# EAGLE design multishield (EAGLE 8.6.1)
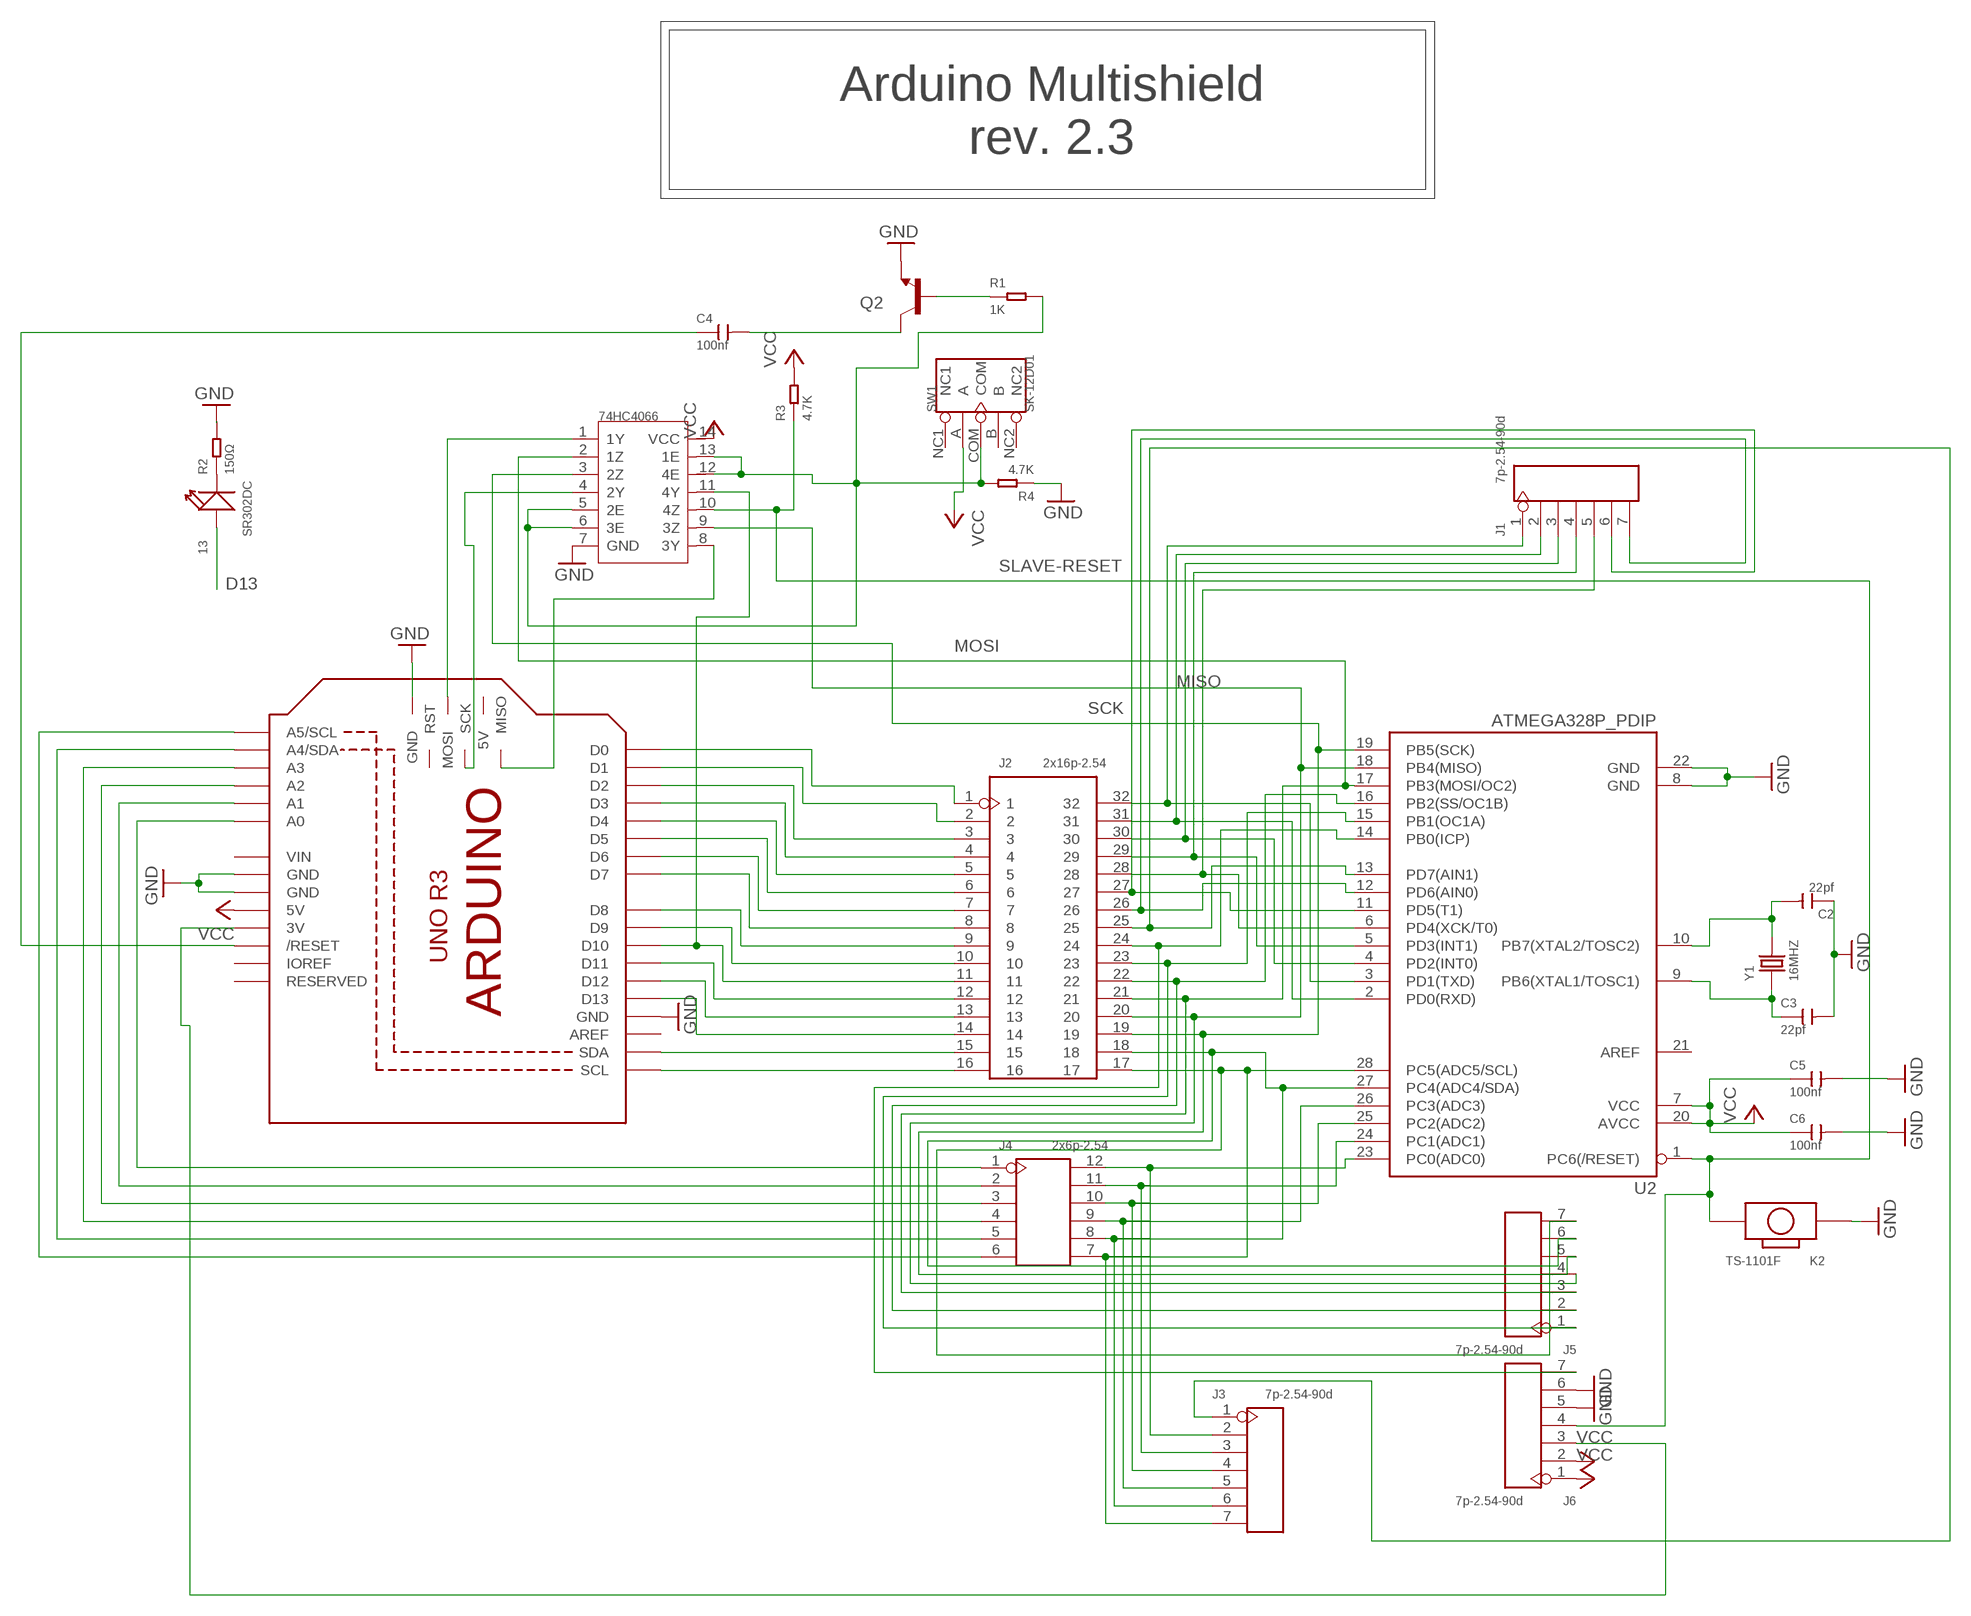
[diagram p0: schematic, sheet 1]

## Parts
13  SR302DC  DIP-LED-RED-RED(2P-D3MM)  [LED2-2.54-D3.0MM]
C2  22pf  DIP-CERAMIC-DISC-22PF-50V-10%-NPO(D4.0MM)  [CERAMIC-2.54]
C3  22pf  DIP-CERAMIC-DISC-22PF-50V-10%-NPO(D4.0MM)  [CERAMIC-2.54]
C4  100nf  DIP-CERAMIC-DISC-100NF-50V-Y5V(D5.0MM)  [CERAMIC-2.54]
C5  100nf  DIP-CERAMIC-DISC-100NF-50V-Y5V(D5.0MM)  [CERAMIC-2.54]
C6  100nf  DIP-CERAMIC-DISC-100NF-50V-Y5V(D5.0MM)  [CERAMIC-2.54]
J1  7p-2.54-90d  DIP-BLACK-MALE-HEADER(7P-2.54-90D)  [H7-2.54-90D-MALE]
J2  2x16p-2.54  DIP-BLACK-MALE-HEADER-VERT(2X16P-2.54)  [H2X16-2.54]
J3  7p-2.54-90d  DIP-BLACK-MALE-HEADER(7P-2.54-90D)  [H7-2.54-90D-MALE]
J4  2x6p-2.54  DIP-BLACK-MALE-HEADER(2X6P-2.54)  [H2X6-2.54]
J5  7p-2.54-90d  DIP-BLACK-MALE-HEADER(7P-2.54-90D)  [H7-2.54-90D-MALE]
J6  7p-2.54-90d  DIP-BLACK-MALE-HEADER(7P-2.54-90D)  [H7-2.54-90D-MALE]
K2  TS-1101F  DIP-BUTTON-FRONT-WHITE(2P-3.4X6MM)  [SW2-3.4X6.0X3.55MM-90D]
M1  ARDUINO_R3_ICSP  [ARDUINOR3_ICSP]
Q2  TRANSISTOR_NPNBC547  [TO-92-AMMO]
R1  1K  DIP-RES-1K-5%-1/4W(PR-D2.3XL6.5MM)  [PR-D2.3XL6.5MM]
R2  150Ω  DIP-RES-1K-5%-1/4W(PR-D2.3XL6.5MM)  [PR-D2.3XL6.5MM]
R3  4.7K  DIP-RES-4.7K-5%-1/4W(PR-D2.3XL6.5MM)  [PR-D2.3XL6.5MM]
R4  4.7K  DIP-RES-4.7K-5%-1/4W(PR-D2.3XL6.5MM)  [PR-D2.3XL6.5MM]
SW1  SK-12D01  DIP-TOGGLE-SWITCH-ON-ON(3+2P-8.8X4.6MM)  [SW5-2.0-8.8X4.4X4.7MM-90D]
U1  AD595AQ-DIP14  74HC4066(DIP14)  [DIP14-2.54-17.24X6.35MM]
U2  ATMEGA328P_PDIP  [DIL28-3]
Y1  16MHZ  DIP-CRYSTAL-16MHZ-18PF-30PPM-50R(HC49US)  [HC49US]

## Nets
D9A: J2.10 M1.D9
D9B: J2.23 J5.1 U2.15(PB1(OC1A))
GND: C2.1 C3.2 C5.2 C6.2 J6.5 J6.6 K2.P$1 M1.GND M1.GND@1(GND) M1.GND@2(GND) M1.GND@3(GND) Q2.3(E) R2.2 R4.1 U1.7(GND) U2.8(GND) U2.22(GND)
MISO: J2.20 J5.4 U1.9(3Z) U2.18(PB4(MISO))
MOSI: J2.21 J5.3 U1.2(1Z) U2.17(PB3(MOSI/OC2))
N$2: J2.1 M1.D0
N$9: J2.2 M1.D1
N$11: J2.3 M1.D2
N$12: J2.4 M1.D3
N$13: J2.5 M1.D4
N$14: J2.6 M1.D5
N$15: J2.7 M1.D6
N$16: J2.8 M1.D7
N$17: J2.9 M1.D8
N$18: 13.K(-) R2.1
N$19: J2.11 M1.D10 U1.11(4Y)
N$20: J2.12 M1.D11
N$21: J2.13 M1.D12
N$22: J2.14 M1.D13
N$23: J2.15 M1.SDA
N$24: J2.16 M1.SCL
N$25: J1.1 J2.32 U2.3(PD1(TXD))
N$26: J1.2 J2.31 U2.2(PD0(RXD))
N$27: J1.3 J2.30 U2.4(PD2(INT0))
N$28: J1.4 J2.29 U2.5(PD3(INT1))
N$29: J1.5 J2.28 U2.6(PD4(XCK/T0))
N$30: J1.6 J2.27 U2.11(PD5(T1))
N$31: J4.1 M1.A0
N$32: J2.25 J3.1 U2.13(PD7(AIN1))
N$33: J2.24 J6.7 U2.14(PB0(ICP))
N$35: J2.22 J5.2 U2.16(PB2(SS/OC1B))
N$36: C4.2 Q2.1(C)
N$37: C4.1 M1.RESET(/RESET)
N$38: Q2.2(B) R1.1
N$39: M1.MOSI U1.1(1Y)
N$40: M1.SCK U1.4(2Y)
N$41: J1.7 J2.26 U2.12(PD6(AIN0))
N$42: J4.2 M1.A1
N$43: J4.3 M1.A2
N$44: J4.4 M1.A3
N$45: J3.2 J4.12 U2.23(PC0(ADC0))
N$46: J3.3 J4.11 U2.24(PC1(ADC1))
N$47: J3.4 J4.10 U2.25(PC2(ADC2))
N$48: J3.5 J4.9 U2.26(PC3(ADC3))
N$49: J2.18 J3.6 J4.8 J5.6 U2.27(PC4(ADC4/SDA))
N$50: J2.17 J3.7 J4.7 J5.7 U2.28(PC5(ADC5/SCL))
N$51: J4.5 M1.A4(A4/SDA)
N$52: J4.6 M1.A5(A5/SCL)
N$53: M1.MISO U1.8(3Y)
N$54: J6.3 M1.3V
N$55: C2.2 U2.10(PB7(XTAL2/TOSC2)) Y1.2
N$56: R1.2 R4.2 SW1.COM U1.5(2E) U1.6(3E) U1.12(4E) U1.13(1E)
N$57: C3.1 U2.9(PB6(XTAL1/TOSC1)) Y1.1
SCK: 13.A(+) J2.19 J5.5 U1.3(2Z) U2.19(PB5(SCK))
SLAVE-RESET: J6.4 K2.P$2 R3.1 U1.10(4Z) U2.1(PC6(/RESET))
VCC: C5.1 C6.1 J6.1 J6.2 M1.5V R3.2 SW1.A U1.14(VCC) U2.7(VCC) U2.20(AVCC)
Unconnected: M1.5V_ICSP(5V) M1.AREF M1.IOREF M1.RESERVED M1.RESET_ICSP(RST) SW1.B SW1.NC1 SW1.NC2 U2.21(AREF)

## Notes on the sheet
- Arduino Multishield
  rev. 2.3
- D13

## Power pins joined to a net without a drawn wire
VIN: M1.VIN

## Library data of the parts
13 = Seeed-OPL-Diode:DIP-LED-RED-RED(2P-D3MM): 304090041; MPN: SR302DC
C2 C3 = Seeed-OPL-Capacitor:DIP-CERAMIC-DISC-22PF-50V-10%-NPO(D4.0MM): 302010200; MPN: CS1-D5Y5V2A104ZSP
C4-C6 = Seeed-OPL-Capacitor:DIP-CERAMIC-DISC-100NF-50V-Y5V(D5.0MM): 302010208; MPN: CC1-F5SL2A101KSPW
J1 J3 J5 J6 = Seeed-OPL-Connector:DIP-BLACK-MALE-HEADER(7P-2.54-90D): 320020093; MPN: P125-1107A0BR138A1
J2 = Seeed-OPL-Connector:DIP-BLACK-MALE-HEADER-VERT(2X16P-2.54): 320020049; MPN: P125-1232A0AS116A1
J4 = Seeed-OPL-Connector:DIP-BLACK-MALE-HEADER(2X6P-2.54): 320020001; MPN: P125-1212A0AS116A1
K2 = Seeed-OPL-Button:DIP-BUTTON-FRONT-WHITE(2P-3.4X6MM): 311020025; MPN: TS-1101F
M1 = adafruit:ARDUINO_R3_ICSP
Q2 = SparkFun-DiscreteSemi:TRANSISTOR_NPN: Generic NPN BJT MMBT2222A - TRANS-08049 (SOT-23, 1A 40V) MPSA42 - TRANS-09116 (SOT-23, 500mA 300V) MMBT5088LT1G - TRANS-11160 (SOT-23, 50 mA 30V) BC547 - COM-08928 <http://www.sparkfun.com/products/8928> (TO-92 45V 100mA) (1.Collector 2.Base 3.Emitter) 2N3904 - COM-00521 <http://www.sparkfun.com/products/521> (TO-92 40V 200mA) (1.Emitter 2.Base 3.Collector) P2N2222A - COM-12852 <http://www.sparkfun.com/products/12852> (TO-92 40V 600mA) (1.Collector 2.Base 3.Emitter)
R1 = Seeed-OPL-Resistor:DIP-RES-1K-5%-1/4W(PR-D2.3XL6.5MM): 301020000; MPN: FHCFR-1/4W-102J
R2 = Seeed-OPL-Resistor:DIP-RES-1K-5%-1/4W(PR-D2.3XL6.5MM): 301020000; MPN: FHCFR-1/4W-102J; VALUE: 1K
R3 R4 = Seeed-OPL-Resistor:DIP-RES-4.7K-5%-1/4W(PR-D2.3XL6.5MM): 301020012; MPN: FHCFR-1/4W-472J
SW1 = Seeed-OPL-Button:DIP-TOGGLE-SWITCH-ON-ON(3+2P-8.8X4.6MM): 311030008; MPN: SK-12D01
U1 = Seeed-OPL-ic:74HC4066(DIP14): 310030269; MPN: AD595AQ
U2 = SparkFun-DigitalIC:ATMEGA328P_PDIP: uC used in the Arduino 32kb flash, 1k EEPROM, 2k SRAM This is the through-hole version of this chip.
Y1 = Seeed-OPL-Crystal-Oscillator:DIP-CRYSTAL-16MHZ-18PF-30PPM-50R(HC49US): 306010037; MPN: 49S/18PF

## Net classes
0 default: width 0.152 mm, drill 0.305 mm, clearance 0.152 mm

## Board
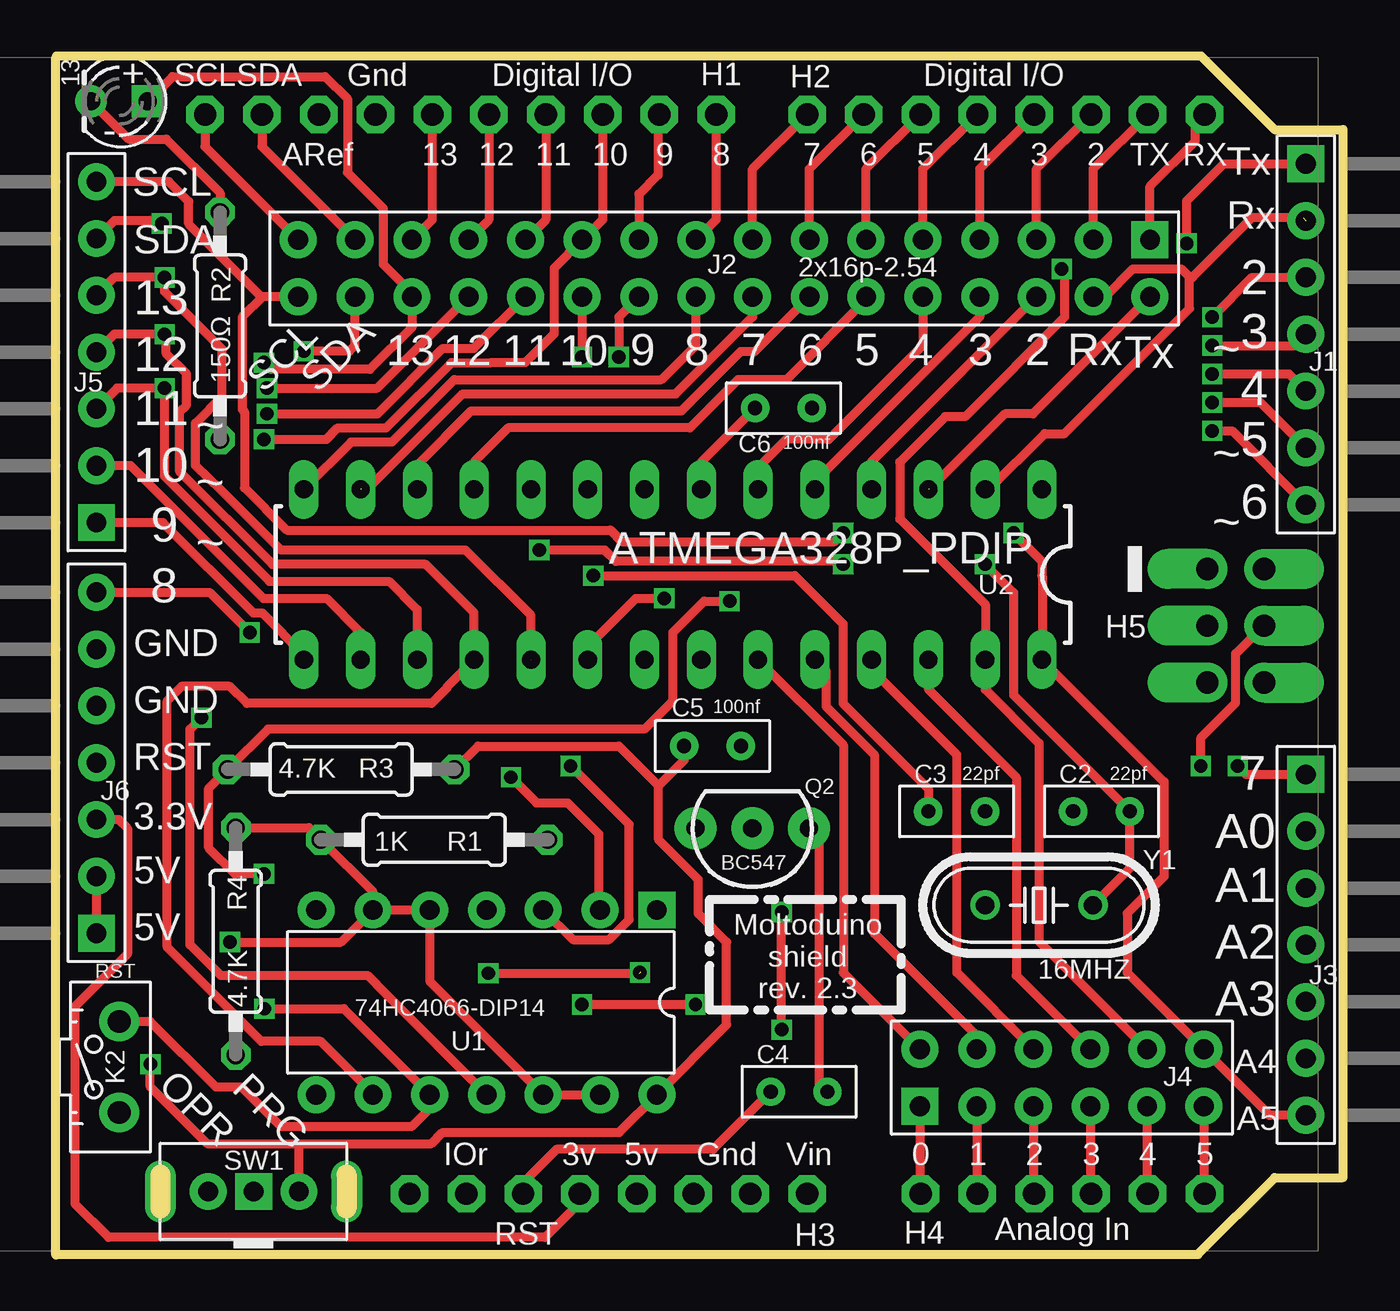
[diagram p1: board, top side]
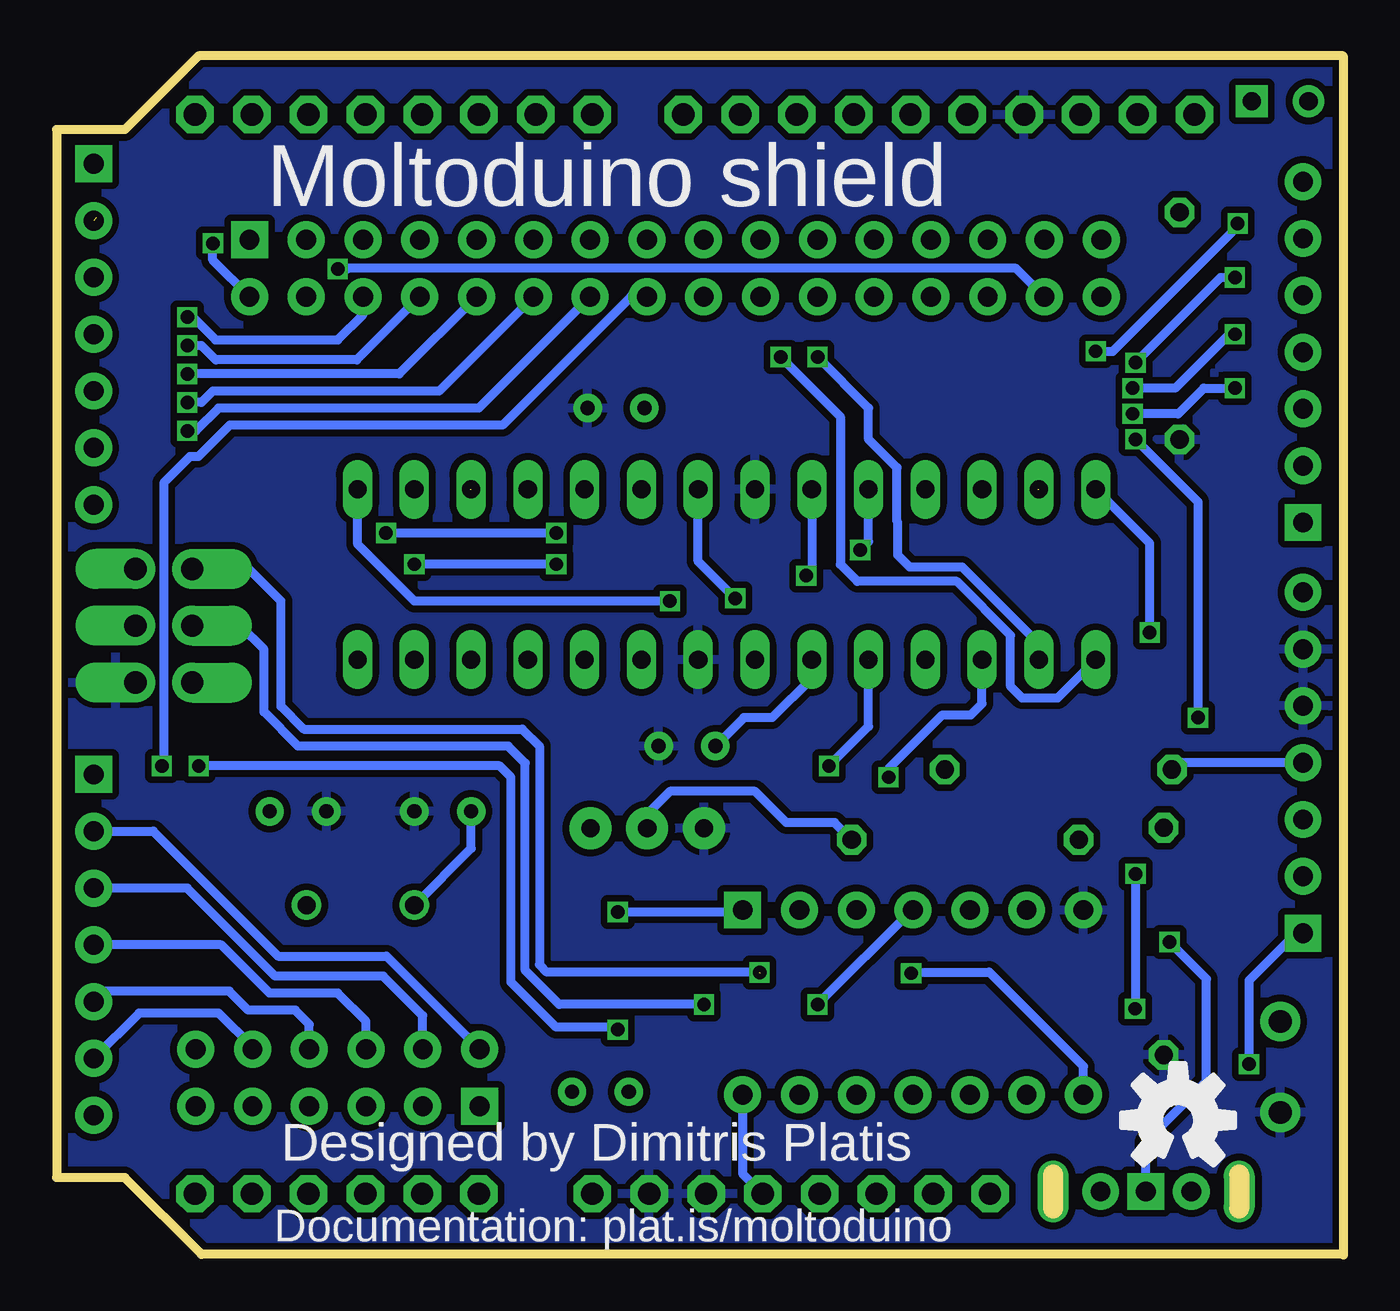
[diagram p2: board, bottom side, seen from below]

Size 57.57 x 53.62 mm. Coordinates in mm from the lower left corner, seen from the top.
Outline: 0,0 0,53.56
Outline: 0.04,0.03 51.09,0.03 54.52,3.46 57.57,3.46 57.57,50.32 54.52,50.32 51.22,53.62 0.04,53.62
Copper layers (1*16): Top 0.035mm / dielectric 1.5mm / Bottom 0.035mm
Design rules "SeeedStudio_2layer_DRU_no_angle_20140221": minimum track width 6mil, minimum drill 12mil, track to track 6mil, track to pad 6mil, pad to pad 6mil, via to via 6mil, smd to smd 0mil, copper to edge 10mil, drill to drill 10mil, minimum pad ring 10mil, minimum via ring 6mil, stop-mask expansion 2mil, vias tented up to drill 100mil, thermal gap 10mil

### Footprints (pad centres in the part's own frame; a part is rotated, then mirrored left to right if it is on the bottom)
LED2-2.54-D3.0MM = drill 0.813 pad 1.422 square: A -1.27,0 | drill 0.813 pad 1.422: K 1.27,0
CERAMIC-2.54 = drill 0.635 pad 1.27: 1 -1.27,0; 2 1.27,0
H7-2.54-90D-MALE = drill 0.889 pad 1.651 square: 1 0,7.62 | drill 0.889 pad 1.651: 2 0,5.08; 3 0,2.54; 4 0,0; 5 0,-2.54; 6 0,-5.08; 7 0,-7.62
H2X16-2.54 = drill 0.889 pad 1.651 square: 1 -1.27,19.05 | drill 0.889 pad 1.651: 2 -1.27,16.51; 3 -1.27,13.97; 4 -1.27,11.43; 5 -1.27,8.89; 6 -1.27,6.35; 7 -1.27,3.81; 8 -1.27,1.27; 9 -1.27,-1.27; 10 -1.27,-3.81; 11 -1.27,-6.35; 12 -1.27,-8.89; 13 -1.27,-11.43; 14 -1.27,-13.97; 15 -1.27,-16.51; 16 -1.27,-19.05; 17 1.27,-19.05; 18 1.27,-16.51; 19 1.27,-13.97; 20 1.27,-11.43; 21 1.27,-8.89; 22 1.27,-6.35; 23 1.27,-3.81; 24 1.27,-1.27; 25 1.27,1.27; 26 1.27,3.81; 27 1.27,6.35; 28 1.27,8.89; 29 1.27,11.43; 30 1.27,13.97; 31 1.27,16.51; 32 1.27,19.05
H2X6-2.54 = drill 0.889 pad 1.651 square: 1 -1.27,6.35 | drill 0.889 pad 1.651: 2 -1.27,3.81; 3 -1.27,1.27; 4 -1.27,-1.27; 5 -1.27,-3.81; 6 -1.27,-6.35; 7 1.27,-6.35; 8 1.27,-3.81; 9 1.27,-1.27; 10 1.27,1.27; 11 1.27,3.81; 12 1.27,6.35
SW2-3.4X6.0X3.55MM-90D = drill 1.016 pad 1.778: P$1 2.032,-0.127; P$2 -2.032,-0.127
ARDUINOR3_ICSP = drill 1 pad 1.676 octagon: 3V 35.56,2.54; 5V 38.1,2.54; A0 50.8,2.54; A1 53.34,2.54; A2 55.88,2.54; A3 58.42,2.54; A4 60.96,2.54; A5 63.5,2.54; AREF 23.876,50.8; D0 63.5,50.8; D1 60.96,50.8; D2 58.42,50.8; D3 55.88,50.8; D4 53.34,50.8; D5 50.8,50.8; D6 48.26,50.8; D7 45.72,50.8; D8 41.656,50.8; D9 39.116,50.8; D10 36.576,50.8; D11 34.036,50.8; D12 31.496,50.8; D13 28.956,50.8; GND 26.416,50.8; GND@1 43.18,2.54; GND@2 40.64,2.54; IOREF 30.48,2.54; RESERVED 27.94,2.54; RESET 33.02,2.54; SCL 18.796,50.8; SDA 21.336,50.8; VIN 45.72,2.54 | drill 1 pad 1.778 offset: 5V_ICSP 66.167,30.48; GND@3 66.167,25.4; MISO 63.627,30.48; MOSI 66.167,27.94; RESET_ICSP 63.627,25.4; SCK 63.627,27.94
TO-92-AMMO = drill 0.813 pad 1.88: 1 -2.54,0; 2 0,0; 3 2.54,0
PR-D2.3XL6.5MM = drill 0.813 octagon: 1 -4.953,0; 2 5.207,0
SW5-2.0-8.8X4.4X4.7MM-90D = drill 0.889 pad 1.651: A 0,2.032; B 0,-2.032 | drill 0.889 pad 1.651 square: COM 0,0 | drill 0.762 pad 1.397 long: NC1 0,4.166; NC2 0,-4.166
DIP14-2.54-17.24X6.35MM = drill 0.889 pad 1.651 square: 1 -7.62,-4.128 | drill 0.889 pad 1.651: 2 -5.08,-4.128; 3 -2.54,-4.128; 4 0,-4.128; 5 2.54,-4.128; 6 5.08,-4.128; 7 7.62,-4.128; 8 7.62,4.128; 9 5.08,4.128; 10 2.54,4.128; 11 0,4.128; 12 -2.54,4.128; 13 -5.08,4.128; 14 -7.62,4.128
DIL28-3 = drill 0.813 long: 1 -16.51,-3.81; 2 -13.97,-3.81; 3 -11.43,-3.81; 4 -8.89,-3.81; 5 -6.35,-3.81; 6 -3.81,-3.81; 7 -1.27,-3.81; 8 1.27,-3.81; 9 3.81,-3.81; 10 6.35,-3.81; 11 8.89,-3.81; 12 11.43,-3.81; 13 13.97,-3.81; 14 16.51,-3.81; 15 16.51,3.81; 16 13.97,3.81; 17 11.43,3.81; 18 8.89,3.81; 19 6.35,3.81; 20 3.81,3.81; 21 1.27,3.81; 22 -1.27,3.81; 23 -3.81,3.81; 24 -6.35,3.81; 25 -8.89,3.81; 26 -11.43,3.81; 27 -13.97,3.81; 28 -16.51,3.81
HC49US = drill 0.813: 1 -2.413,0; 2 2.413,0

### Placement (x,y rotation side)
13  2.84,51.59 180 top
C2  46.77,19.84 0 top
C3  40.3,19.84 0 top
C4  33.24,7.3 0 top
C5  29.37,22.76 0 top
C6  32.55,37.87 0 top
J1  55.92,41.17 0 top
J2  29.89,44.12 270 top
J3  55.92,13.87 0 top
J4  45,7.93 90 top
J5  1.81,40.38 180 top
J6  1.81,22.01 180 top
K2  2.96,8.41 270 top
M1  -12.12,0.2 0 top
Q2  31.15,19.08 180 top
R1  17.05,18.57 180 top
R2  7.34,41.67 270 top
R3  12.63,21.71 0 top
R4  8.04,13.9 90 top
SW1  8.84,2.84 270 top
U1  19.26,11.3 180 top
U2  27.6,30.43 180 top
U$4  [OSHWLOGO_BACK_0.2]  7.4,6.03 0 top
Y1  43.98,15.65 0 top

### Tracks (layer width: path | path; a pad name or v marks a point on that pad's centre or on a via)
D9A
  Top 0.406: M1.D9 26.94,50.95 26.94,48.3 26.08,47.44 J2.10
D9B  (via drill 0.6)
  Top 0.406: v25.18,40.16 25.18,41.95 J2.23 26.1,42.85 | U2.15 11.09,26.85 9.24,28.7 8.84,28.7 4.79,32.75 J5.1
  Bottom 0.406: v25.18,40.16 22.52,37.49 22.52,30.89 21.75,30.13 17.31,30.13 14.9,27.71 14.9,25.43 14.39,24.92 12.79,24.92 U2.15
GND
  pour Bottom (isolate 0.305): 0.35,53.56 57.46,53.44 57.46,0.03 0.4,0.15
MISO  (via drill 0.6)
  Top 0.406: v9.44,38.76 14.37,38.76 J2.20 | U1.9 14.18,7.22 11.85,9.55 9.19,9.55 4.99,13.75 4.99,24.79 5.62,25.43 7.78,25.43 8.55,24.66 16.8,24.66 17.52,25.38 17.52,25.43 U2.18 18.71,28.73 16.55,30.89 9.69,30.89 5.54,35.03 5.54,37.7 5.84,38 5.84,39.4 4.94,40.3 4.94,41.09 v4.86,41.17 2.61,41.17 J5.4
  Bottom 0.406: v9.44,38.76 7.53,38.76 5.12,41.17 v4.86,41.17
MOSI  (via drill 0.6)
  Top 0.406: U1.2 24.29,15.47 24.29,18.82 22.9,20.22 21.5,20.22 v20.36,21.36 | U2.17 16.17,28.86 14.9,30.13 9.56,30.13 4.86,34.82 v4.86,38.76 2.74,38.76 J5.3 | v9.44,37.62 14.39,37.62 17.31,40.54 18.69,40.54 J2.21
  Bottom 0.406: U2.17 16.17,24.66 16.67,24.16 17.94,24.16 20.36,21.74 v20.36,21.36 | v9.44,37.62 7.4,37.62 6.26,38.76 v4.86,38.76
N$2
  Top 0.406: J2.1 48.95,47.79 50.96,49.81 50.96,50.58 M1.D0
N$9
  Top 0.406: J2.2 46.41,48.56 M1.D1
N$11
  Top 0.406: J2.3 43.87,48.56 M1.D2
N$12
  Top 0.406: J2.4 41.33,48.56 M1.D3
N$13
  Top 0.406: J2.5 38.79,48.56 M1.D4
N$14
  Top 0.406: J2.6 36.25,48.56 M1.D5
N$15
  Top 0.406: J2.7 33.71,48.56 M1.D6
N$16
  Top 0.406: J2.8 31.16,48.56 M1.D7
N$17
  Top 0.406: M1.D8 29.54,46.3 J2.9
N$18
  Top 0.406: R2.1 7.34,47.5 4.94,49.9 3.26,49.9 13.K
N$19  (via drill 0.6)
  Top 0.406: M1.D10 24.46,46.3 J2.11 22.29,44.14 22.29,41.2 20.99,39.91 19.47,39.91 | U1.11 14.37,12.07 14.37,12.08 13.94,12.5 7.38,12.5 6.01,13.87 6.01,23.52 v6.51,24.03 | 19.47,39.91 17.69,39.91 14.77,36.98 12.61,36.98 12.1,36.48 v9.31,36.48 | 19.47,39.91 19.48,39.91
  Bottom 0.406: v6.51,24.03 6.51,33.68 v9.31,36.48
N$20
  Top 0.406: M1.D11 21.92,46.3 J2.12
N$21
  Top 0.406: M1.D12 19.38,46.3 J2.13
N$22
  Top 0.406: M1.D13 16.84,46.3 J2.14
N$23
  Top 0.406: M1.SDA 9.22,49.56 J2.15
N$24
  Top 0.406: M1.SCL 6.68,49.56 J2.16
N$25  (via drill 0.6)  (1 unrouted)
  Top 0.406: v50.58,45.24 50.58,47.14 52.23,48.8 J1.1 | J2.32 43.71,37.62 42.46,37.62 39.08,34.24
  Bottom 0.406: J2.32 50.58,44.49 v50.58,45.24
N$26  (1 unrouted)
  Top 0.406: J2.31 46.94,42.85 48.18,44.1 50.34,44.1 50.72,43.71 | 50.72,43.71 50.84,43.71 53.5,46.38 55.79,46.38 | 50.72,43.71 50.71,43.7 50.71,42.32 45.12,36.73 44.23,36.73 41.74,34.24 U2.2
N$27  (via drill 0.6)
  Top 0.406: U2.4 36.49,35.48 J2.30 | J1.3 53.5,43.71 v51.73,41.94
  Bottom 0.406: J2.30 43.87,42.05 45,40.92 50.47,40.92 50.47,40.93 51.47,41.94 v51.73,41.94
N$28  (via drill 0.6)
  Top 0.406: J2.29 41.33,41.95 33.95,34.58 U2.5 | v51.73,40.67 55.41,40.67 J1.4
  Bottom 0.406: J2.29 44.15,40.03 50.46,40.03 51.09,40.67 v51.73,40.67
N$29  (via drill 0.6)
  Top 0.406: J2.28 38.79,40.68 34.58,36.48 32.68,36.48 31.41,35.21 U2.6 | v51.73,39.4 55.16,39.4 J1.5
  Bottom 0.406: J2.28 42.24,39.4 v51.73,39.4
N$30  (via drill 0.6)
  Top 0.406: U2.11 18.71,35.47 20.23,36.98 28.36,36.98 30.52,39.14 32.68,39.14 36.25,42.71 J2.27 | J1.6 53.89,38.13 v51.73,38.13
  Bottom 0.406: J2.27 40.46,38.63 50.58,38.63 51.09,38.13 v51.73,38.13
N$31
  Top 0.406: J4.1 38.65,2.77 M1.A0
N$32  (via drill 0.6)  (1 unrouted)
  Top 0.406: J2.25 31.16,41.95 27.72,38.51 18.2,38.51 13.93,34.24 13.68,34.24 | v52.87,21.87 53.25,21.49 J3.1
  Bottom 0.406: J2.25 31.89,42.85 37.63,37.11 49.82,37.11 51.22,35.71 51.6,35.71 52.78,34.53 52.78,21.96 v52.87,21.87
N$33  (via drill 0.6)
  Top 0.406: J2.24 28.62,40.68 27.09,39.14 17.82,39.14 15.02,36.35 13.2,36.35 U2.14 | J6.7 6.88,29.63 v8.67,27.84
  Bottom 0.406: v8.67,27.84 8.67,31.82 U2.14
N$35  (via drill 0.6)
  Top 0.406: J2.22 23.54,40.17 v23.53,40.16 | U2.16 13.63,27.83 12.1,29.36 9.28,29.36 3.34,35.3 J5.2
  Bottom 0.406: v23.53,40.16 21.25,37.87 21.25,36.48 19.98,35.21 19.98,32.79 19.94,32.76 19.94,31.3 19.4,30.76 17.05,30.76 13.63,27.34 U2.16
N$36
  Top 0.406: Q2.1 34.14,18.63 34.14,7.67 C4.2
N$37
  Top 0.406: M1.RESET 20.9,3.24 22.39,4.73 29.4,4.73 C4.1
N$38
  Bottom 0.406: R1.1 22.77,19.33 24.93,19.33 26.33,20.73 30.14,20.73 31.15,19.71 Q2.2
N$39  (via drill 0.6)
  Top 0.406: v32.47,10.08 v32.47,15.34 | v51.22,21.87 51.22,23.14 52.78,24.7 52.78,26.89 M1.MOSI
  Bottom 0.406: v32.47,15.34 26.96,15.34 U1.1 | v32.47,10.08 32.58,10.19 35.23,10.19 37.24,12.2 37.24,21.36 37.76,21.87 v51.22,21.87
N$40  (via drill 0.6)
  Top 0.406: v23.53,11.2 v28.61,11.2
  Bottom 0.406: v23.53,11.2 19.31,15.43 U1.4 | v28.61,11.2 35.09,11.2 36.61,12.73 36.61,22 37.38,22.76 46.77,22.76 48.3,24.28 48.3,27.08 49.36,28.14 M1.SCK
N$41  (via drill 0.6)
  Top 0.406: J2.26 31.26,40.41 30.64,40.41 27.98,37.75 18.58,37.75 16.17,35.34 U2.12 | v51.73,36.86 52.62,36.86 J1.7
  Bottom 0.406: J2.26 38.69,37.87 50.33,37.87 51.34,36.86 v51.73,36.86
N$42
  Top 0.406: J4.2 41.19,2.77 M1.A1
N$43
  Top 0.406: J4.3 43.73,2.77 M1.A2
N$44
  Top 0.406: J4.4 46.27,2.77 M1.A3
N$45
  Top 0.406: J4.12 35.22,12.63 35.22,22.81 U2.23
  Bottom 0.406: 38.8,9.2 J4.12 42.81,13.36 47.66,13.36 53.25,18.95 J3.2
N$46
  Top 0.406: U2.24 34.45,26.12 34.45,24.54 36.61,22.38 36.61,14.38 41.19,9.8 J4.11
  Bottom 0.406: J4.11 41.19,10.7 42.96,12.47 47.79,12.47 51.73,16.41 J3.3
N$47
  Top 0.406: U2.25 36.49,26.18 40.3,22.38 40.3,12.63 J4.10
  Bottom 0.406: J4.10 43.73,10.45 45,11.71 48.04,11.71 50.2,13.87 J3.4
N$48
  Top 0.406: J4.9 42.96,12.51 42.96,21.36 39.03,25.29 U2.26
  Bottom 0.406: J4.9 46.27,10.31 46.9,10.95 48.99,10.95 49.84,11.8 55.45,11.8 J3.5
N$49  (via drill 0.6)
  Top 0.406: J4.8 43.98,14.03 43.98,22.89 41.57,25.29 U2.27 41.57,29.1 37.76,32.92 37.76,35.46 39.79,37.49 40.68,37.49 45.12,41.94 45.12,43.97 v45,44.1 | J2.18 13.37,40.67 13.12,40.41 v11.09,40.41 | v4.74,46.13 4.61,46.25 2.61,46.25 J5.6
  Bottom 0.406: J2.18 14.65,44.12 44.55,44.12 44.58,44.1 v45,44.1 | J4.8 48.81,9.3 50.33,10.82 53.89,10.82 J3.6 | U2.27 | v11.09,40.41 10.32,40.41 4.74,46 v4.74,46.13
N$50  (via drill 0.6)
  Top 0.406: J3.7 54.3,6.25 J4.7 47.92,12.63 47.92,15.27 49.57,16.92 49.57,21.16 U2.28 44.12,30.38 44.11,30.39 44.11,31.01 v42.84,32.28 | v35.22,32.28 34.84,31.9 25.31,31.9 24.8,32.41 10.33,32.41 8.44,34.3 8.44,37.7 8.34,37.8 8.34,41.95 9.24,42.85 | J2.17 9.24,42.85 | 9.24,42.85 9.19,42.85 5.94,46.1 5.94,47.1 5.05,47.99 J5.7
  Bottom 0.406: v35.22,32.28 v42.84,32.28
N$51
  Top 0.406: J4.5 48.81,2.77 M1.A4
N$52
  Top 0.406: J4.6 51.35,2.77 M1.A5
N$53  (via drill 0.6)  (2 unrouted)
  Top 0.406: v19.34,12.6 26.09,12.6
  Bottom 0.406: U1.8 11.64,8.44 15.85,12.65 15.87,12.63 19.31,12.63 v19.34,12.6 | 26.15,12.65 35.65,12.65 35.98,12.98 35.98,22.76 36.74,23.52 46.52,23.52 47.54,24.54 47.54,29.24 48.98,30.68 M1.MISO
  other vias: 26.13,12.63
N$54
  Top 0.406: M1.3V 23.44,2.35 21.88,0.79 2.35,0.79 0.84,2.3 0.84,11.1 3.21,13.47 3.21,19.08 2.81,19.47 J6.3
N$55  (via drill 0.6)
  Top 0.406: Y1.2 48.04,17.3 C2.2 42.84,25.05 42.84,29.62 v41.57,30.89 | v21.63,31.52 24.55,31.52 25.06,31.01 35.09,31.01 v35.22,30.89
  Bottom 0.406: v21.63,31.52 21.25,31.9 U2.10 | v35.22,30.89 v41.57,30.89
N$56  (via drill 0.6)
  Top 0.406: U1.13 U1.12 16.72,12.25 U1.5 U1.6 | v7.78,14 12.75,14 U1.6 | U1.6 14.18,16.24 R1.2 11.31,19.11 R4.2
  Bottom 0.406: v7.78,14 6.13,12.35 6.13,7.77 8.84,5.07 SW1.COM
N$57  (via drill 0.6)
  Top 0.406: v24.04,30.38 33.06,30.38 35.22,28.22 35.22,24.66 39.03,20.85 C3.1
  Bottom 0.406: Y1.1 39.03,18.19 C3.1 | U2.9 23.79,30.63 v24.04,30.38
SCK  (via drill 0.6)  (1 unrouted)
  Top 0.406: U2.19 21.25,28.6 18.32,31.52 10.07,31.52 7.4,34.19 6.24,35.3 6.24,37.2 7.44,38.4 7.44,40.5 4.86,43.08 v4.86,43.71 2.61,43.71 J5.5 | v9.31,39.91 9.61,39.6 14.04,39.6 15.92,41.48 J2.19 15.92,43.02 14.64,44.3 14.64,46.8 13.04,48.4 13.04,51.7 12.04,52.7 5.22,52.7 13.A | U1.3 23.13,14.1 24.74,14.1 25.64,15 25.64,19.25 v23.02,21.87
  Bottom 0.406: U2.19 21.25,23.64 v23.02,21.87 | v9.31,39.91 5.5,43.71 v4.86,43.71
SLAVE-RESET  (via drill 0.6)
  Top 0.406: v30.14,29.24 28.99,29.24 27.6,27.84 27.6,24.79 26.33,23.52 9.49,23.52 R3.1 6.84,20.88 6.84,18.2 8,17.04 v9.31,17.04 | K2.P$2 4.23,10.44 7.15,7.52 8.29,7.52 10.07,5.74 15.91,5.74 16.72,6.55 U1.10 12.88,11.01 v9.33,11.01
  Bottom 0.406: v30.14,29.24 41.57,29.24 44.11,31.78 U2.1 | v9.31,17.04 9.31,11.04 v9.33,11.01 | J6.4 7.38,22.01 R3.1
VCC  (via drill 0.6)
  Top 0.406: 26.96,20.98 26.96,18.57 28.74,16.79 28.74,15.27 30.01,14 30.01,10.3 U1.14 25.2,5.49 17.31,5.49 16.8,4.98 10.83,4.98 | R3.2 18.88,22.76 25.18,22.76 26.96,20.98 | 10.83,4.98 6.77,4.98 4.23,7.52 v4.23,8.54 | SW1.A 10.87,4.94 10.83,4.98 | v27.21,29.36 25.95,29.36 23.79,27.2 U2.20 | U2.7 28.87,35.47 C6.1 | 26.96,20.98 28.1,22.12 C5.1 | J6.2 J6.1
  Bottom 0.406: U1.14 26.88,3.64 M1.5V | U2.20 23.79,25.8 25.56,24.03 26.83,24.03 C5.1 | v27.21,29.36 28.87,31.02 U2.7 | v4.23,8.54 4.23,12.28 2.11,14.39 J6.1

### Text on the board
tPlace: Tx | SCL | Rx | SDA | 2 | 13 | 3 | 12 | 13 | 12 | 11 | 10 | 9 | 8 | 7 | 6 | 5 | 4 | 3 | 2 | Rx | Tx | ~ | SCL | SDA | 4 | 11 | ~ | 5 | 10 | ~ | ~ | 6 | 9 | ~ | ~ | 8 | GND | GND | RST | 7 | 3.3V | A0 | 5V | A1 | Moltoduino / shield / rev. 2.3 | 5V | A2 | RST | A3 | A4 | OPR | PRG | A5
bPlace: Moltoduino shield | Designed by Dimitris Platis | Documentation: plat.is/moltoduino
tNames: H1 | H2 | H5 | BC547 | 74HC4066-DIP14 | H4 | H3